# Altium schematic sheet TemperatureSensor.SchDoc
size 420 x 297 mm; SheetNumber: 10; SheetTotal: 15
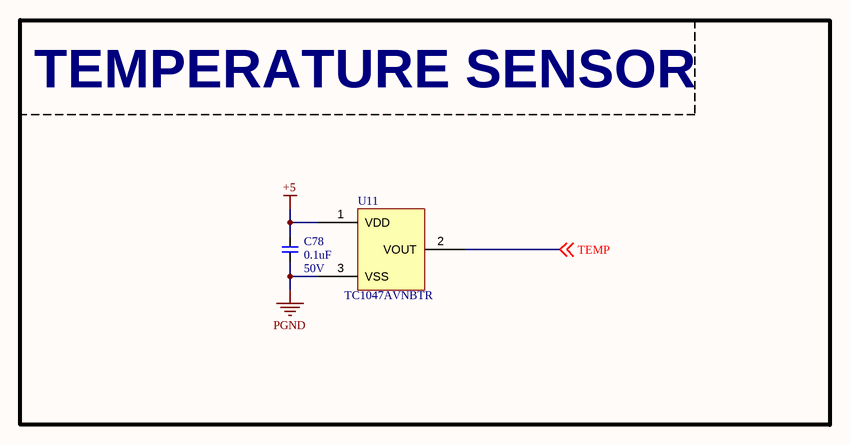
[diagram p0: TemperatureSensor.SchDoc]

## Parts
C78  0.1uF  Voltage: 50V  [CAP_C_1608X80]
U11  TC1047AVNBTR  [SOT-23]

## Blocks framed on the sheet
TEMPERATURE SENSOR: C78 U11

## Nets
+5: C78.1 U11.1(VDD)
PGND: C78.2 U11.3(VSS)
TEMP: U11.2(VOUT) ; off-sheet TEMP

## Notes on the sheet
- Project:
- DAL_PDU
- Sub-system:
- IGRVT-50
- Design by:
- KIEN HOANG
- BAO BUI
- Sheet title:
- Sheet
- A3
- of
- Checked by:
- Approved by:
- VU PHAM
- Revision:
- Document No:
- Size:
- Date:

## Library data of the parts
C78 = _CAP_C_2: CAP